# Altium schematic sheet ETH_SWITCH.SchDoc
size 594 x 420 mm; PageSetup: Record=PageOptions|CenterHorizontal=True|CenterVertical=True|PrintScale=0.94|XCorrection=1.00|YCorrection=1.00|PrintKind=1|BorderSize=5000000|LeftOffset=0|BottomOffset=0|Orientation=1|PaperLength=1000|PaperWidth=1000|Scale=100|PaperSource=7|PrintQuality=-4|MediaType=1|DitherType=10|PaperKind=A4|PrintScaleMode=1; Address1: Address1; Address2: Address2; Address3: Address3; Address4: Address4
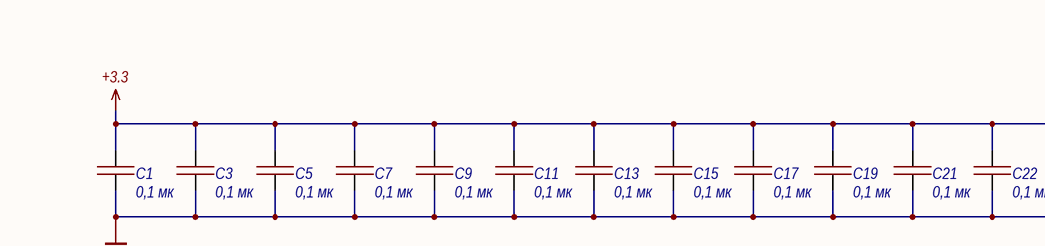
[diagram p0: ETH_SWITCH.SchDoc, top left]
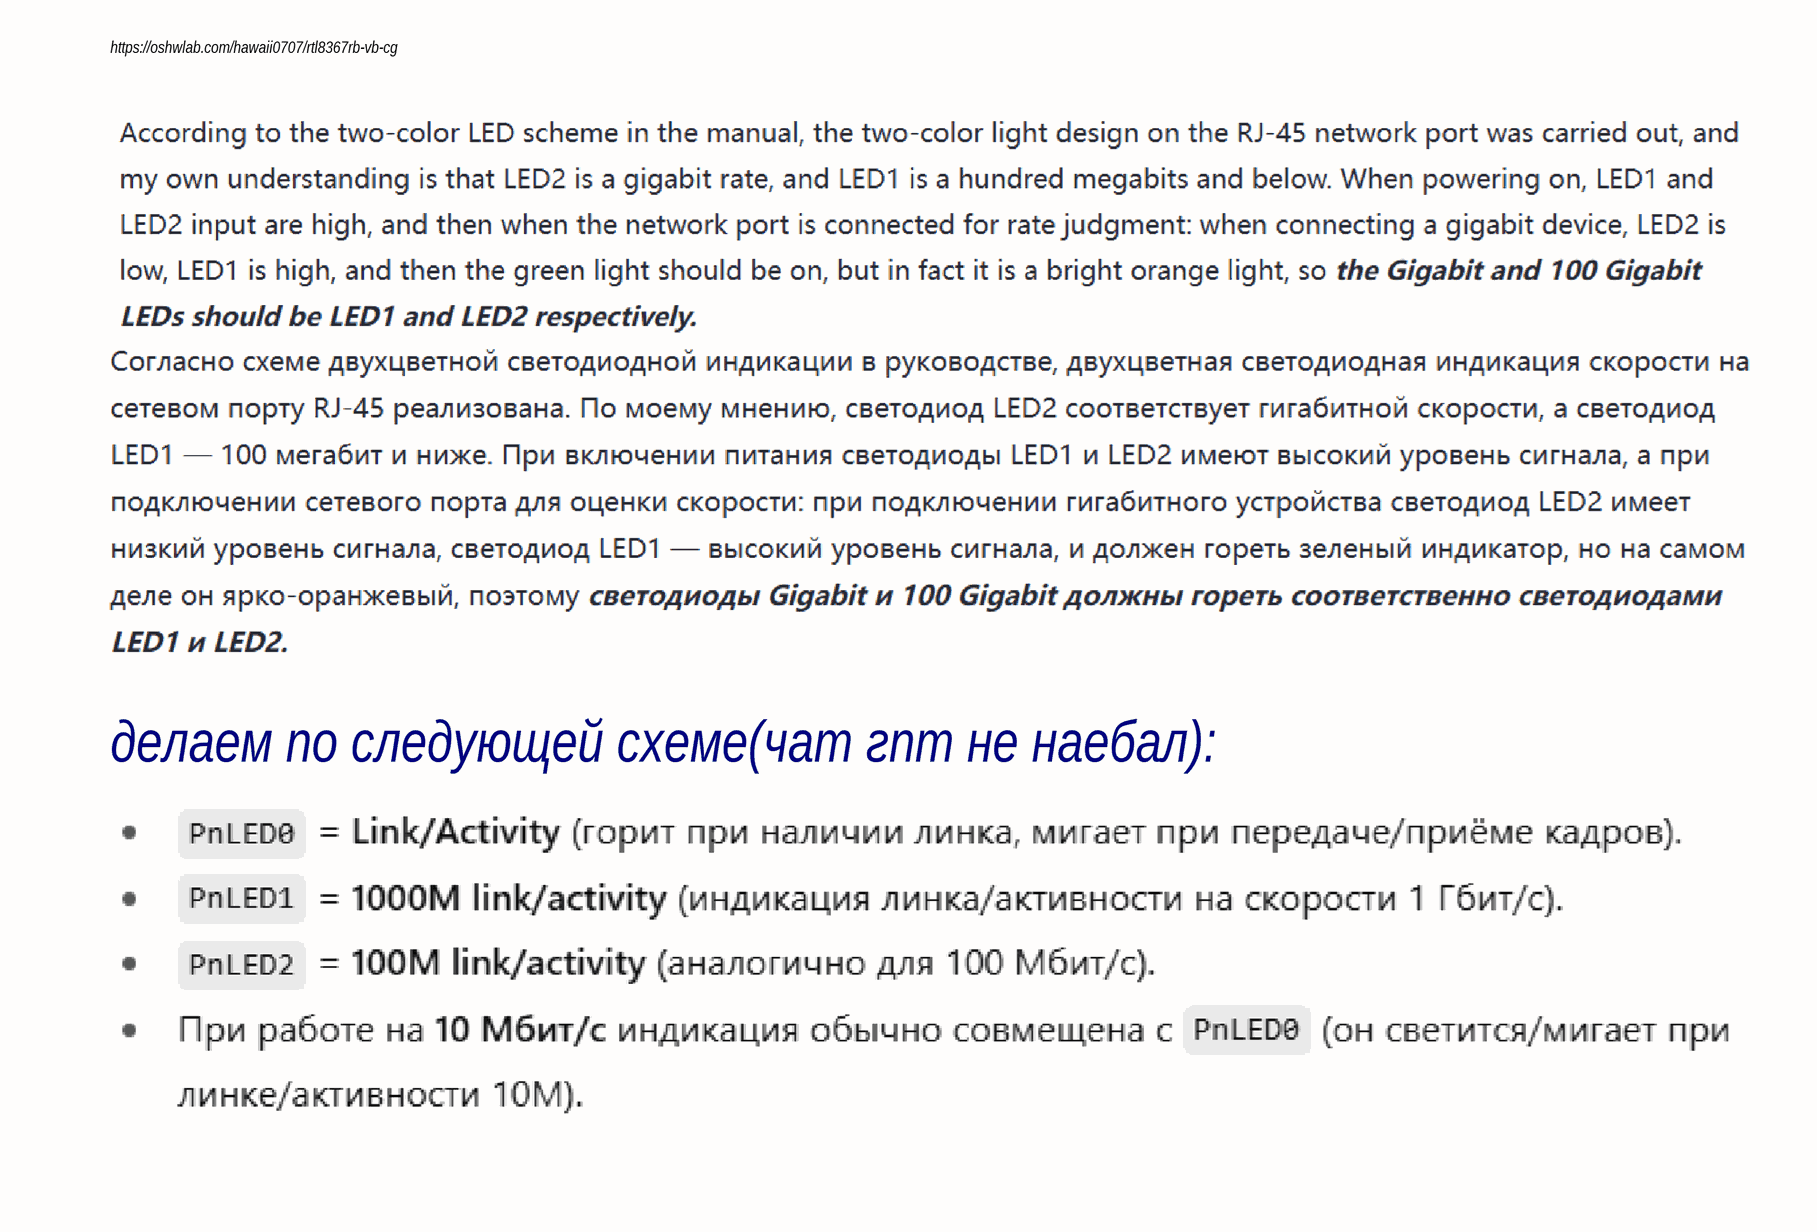
[diagram p1: ETH_SWITCH.SchDoc, top right]
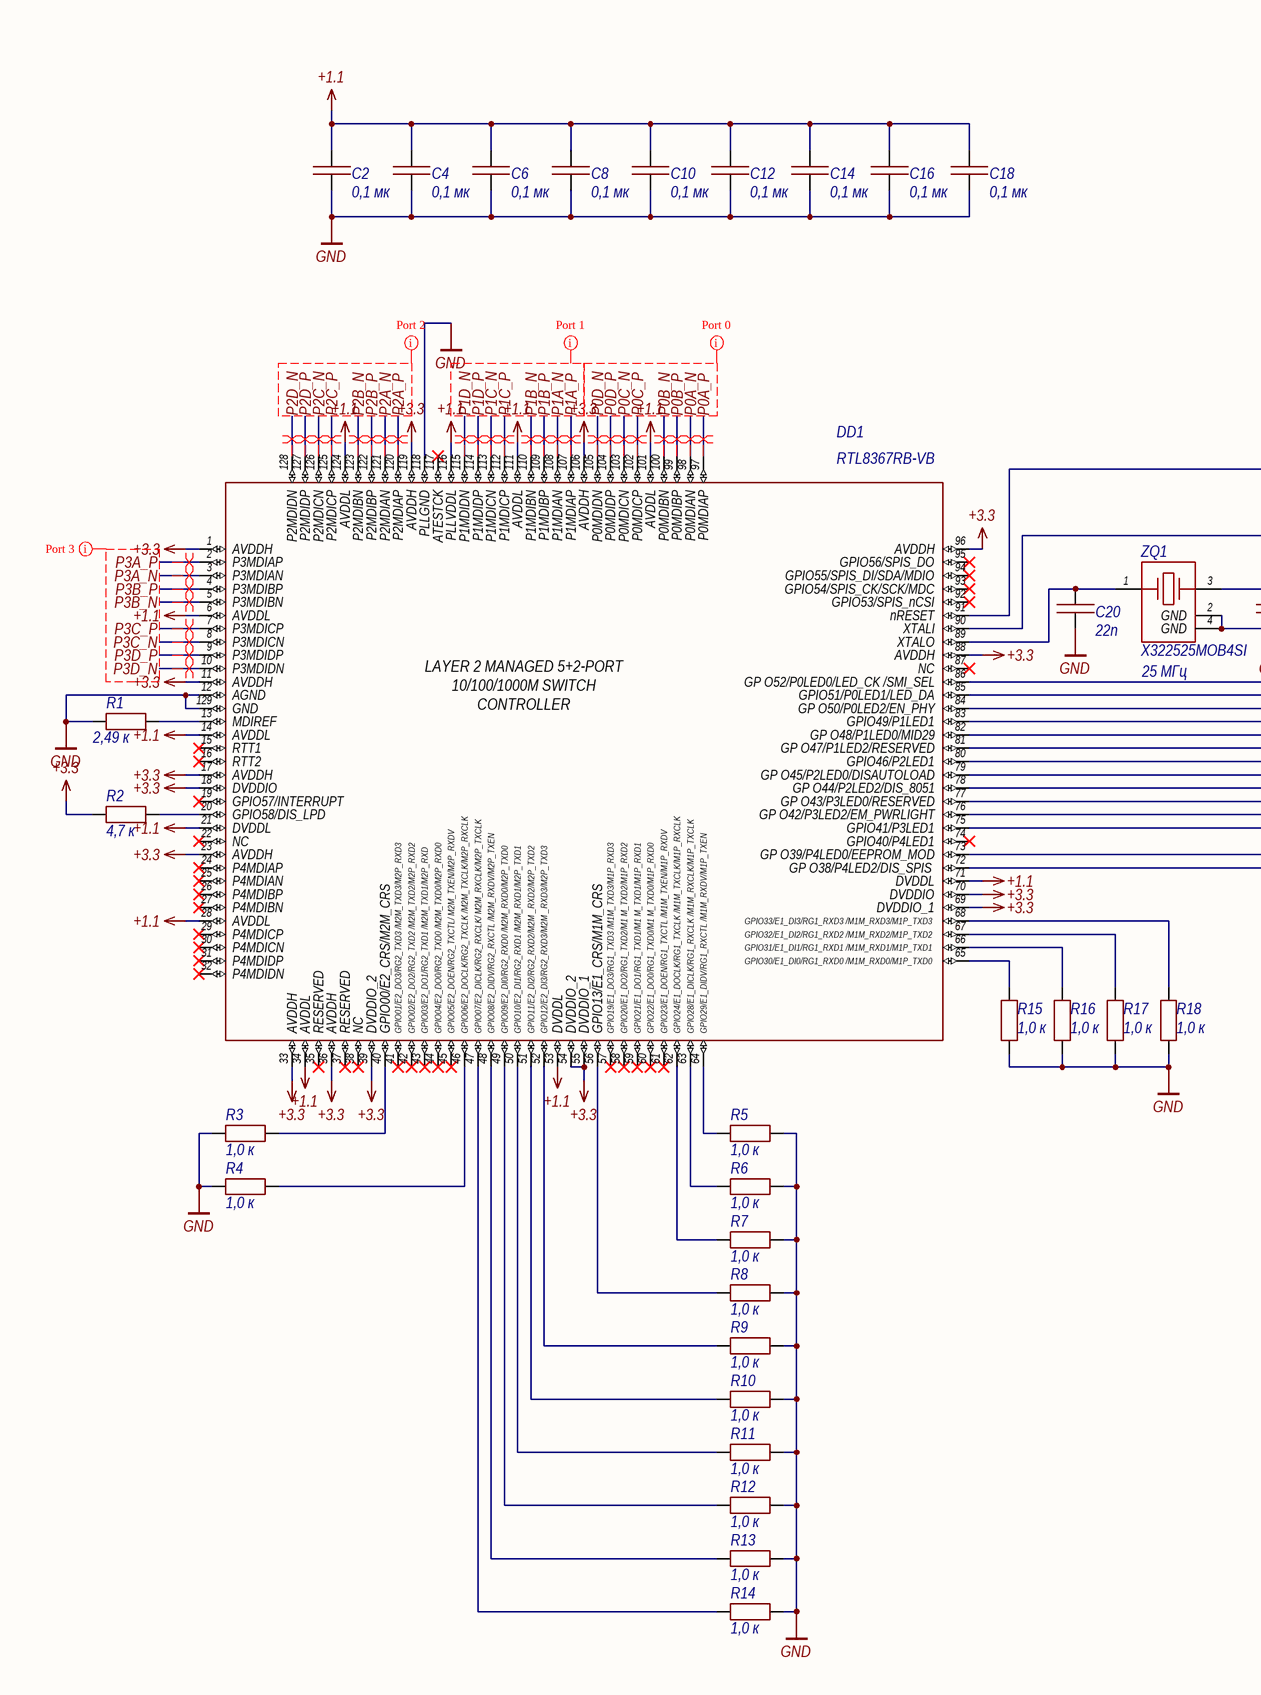
[diagram p2: ETH_SWITCH.SchDoc, bottom left]
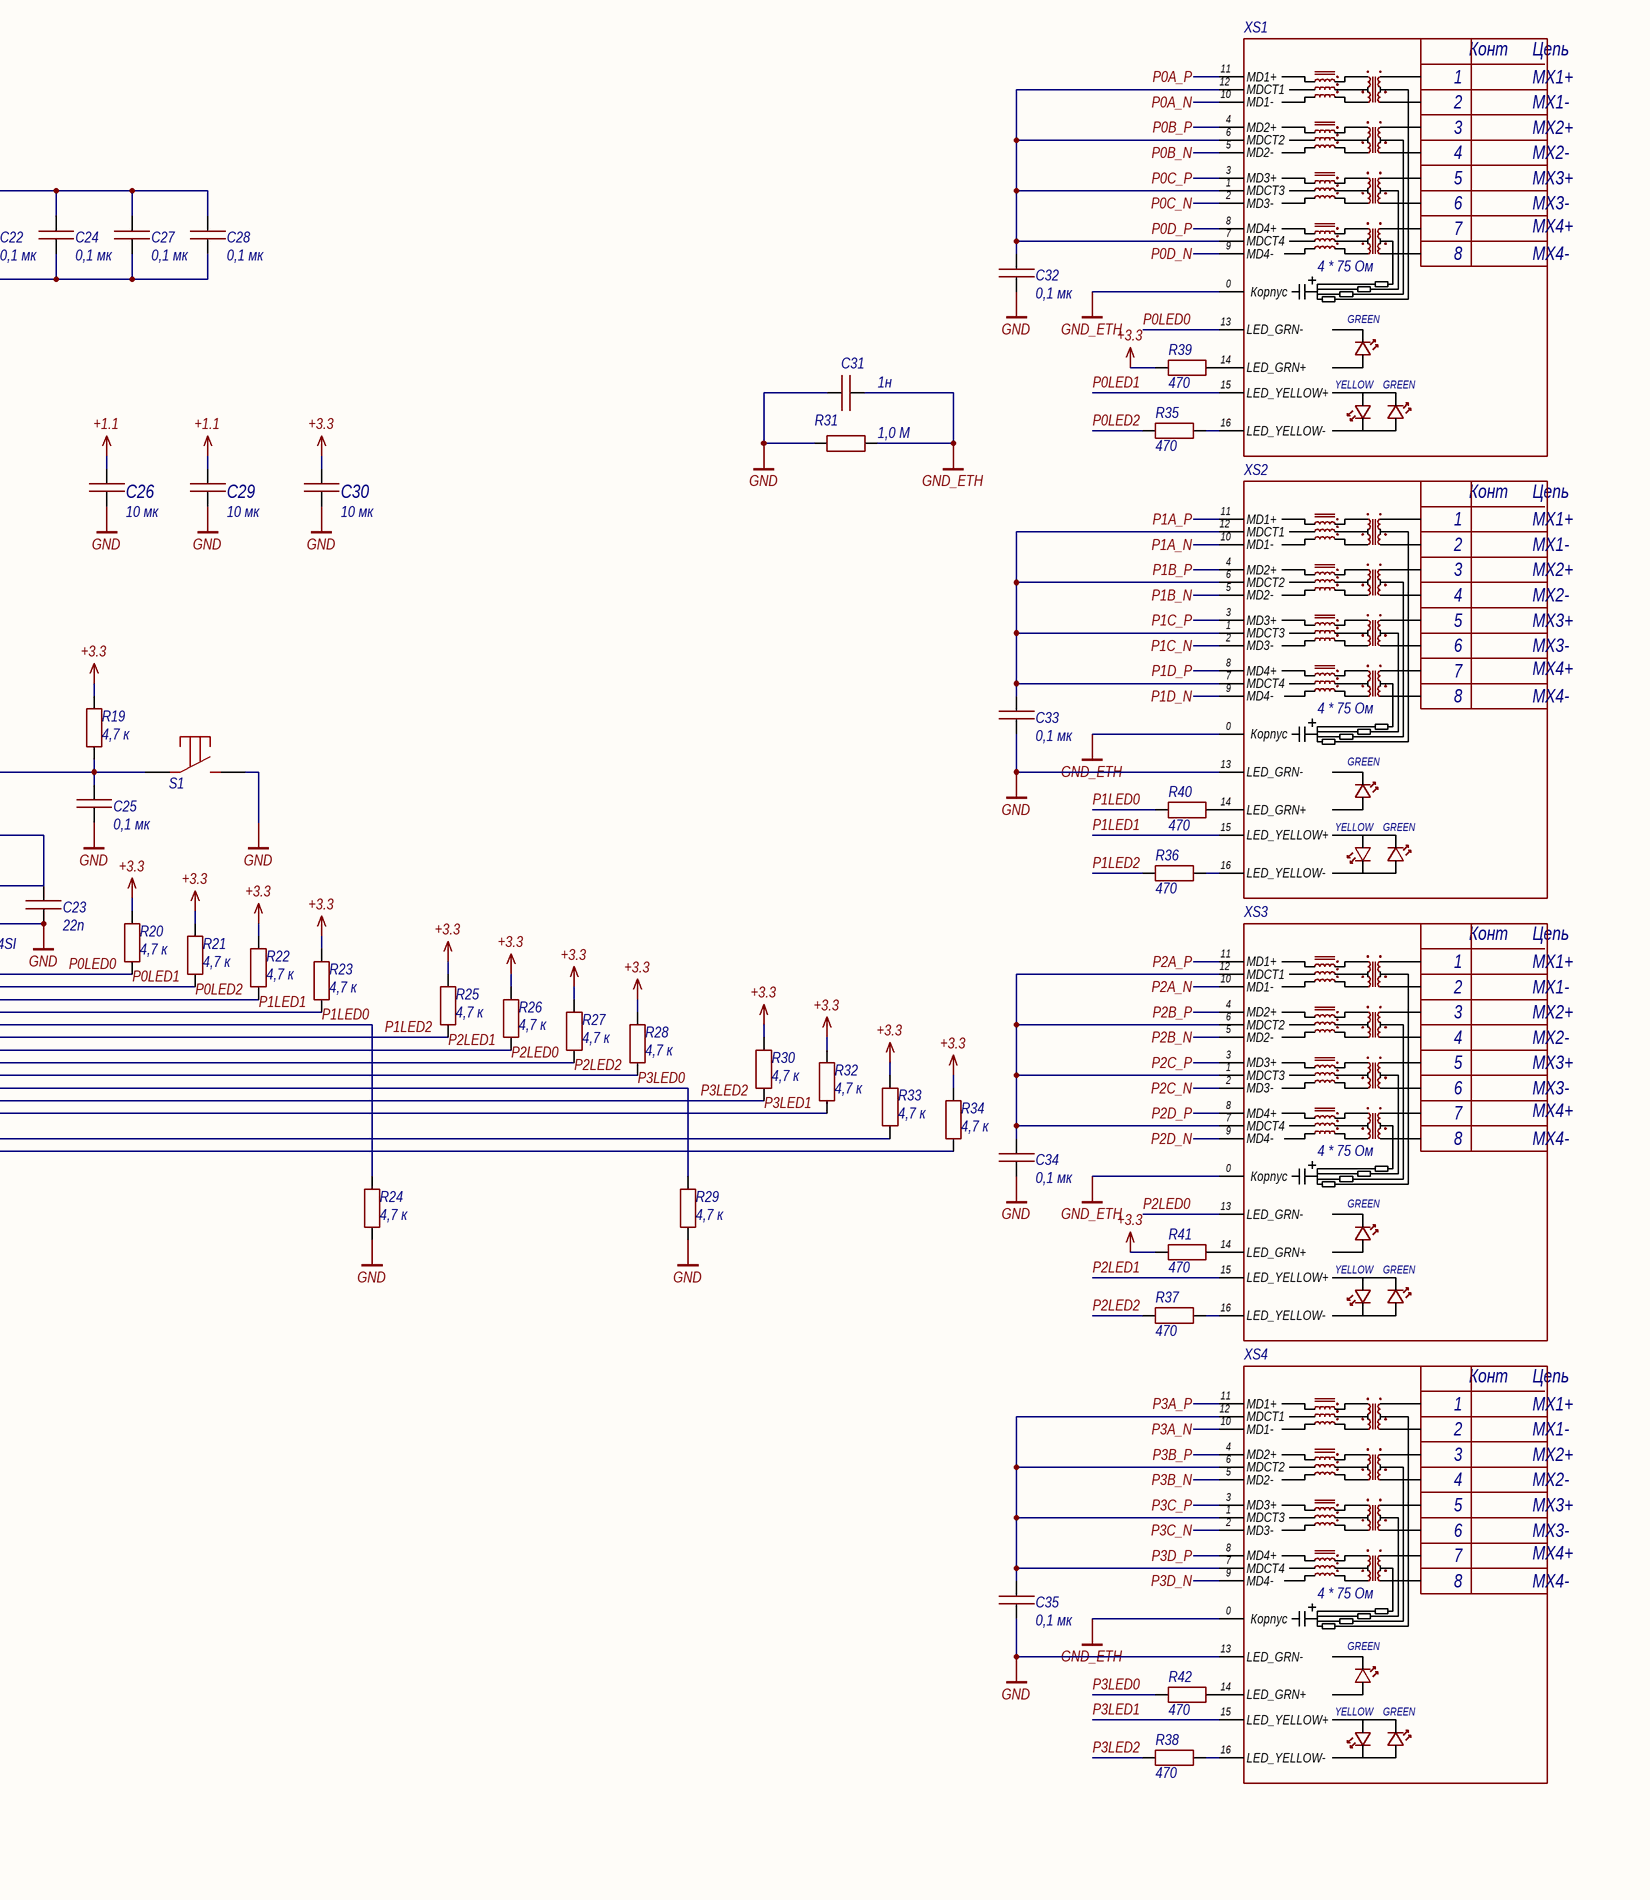
[diagram p3: ETH_SWITCH.SchDoc, bottom right]

## Parts
C1  value 0,1 мк  [0402C]  (hidden comment: Capacitor)
C2  value 0,1 мк  [0402C]  (hidden comment: Capacitor)
C3  value 0,1 мк  [0402C]  (hidden comment: Capacitor)
C4  value 0,1 мк  [0402C]  (hidden comment: Capacitor)
C5  value 0,1 мк  [0402C]  (hidden comment: Capacitor)
C6  value 0,1 мк  [0402C]  (hidden comment: Capacitor)
C7  value 0,1 мк  [0402C]  (hidden comment: Capacitor)
C8  value 0,1 мк  [0402C]  (hidden comment: Capacitor)
C9  value 0,1 мк  [0402C]  (hidden comment: Capacitor)
C10  value 0,1 мк  [0402C]  (hidden comment: Capacitor)
C11  value 0,1 мк  [0402C]  (hidden comment: Capacitor)
C12  value 0,1 мк  [0402C]  (hidden comment: Capacitor)
C13  value 0,1 мк  [0402C]  (hidden comment: Capacitor)
C14  value 0,1 мк  [0402C]  (hidden comment: Capacitor)
C15  value 0,1 мк  [0402C]  (hidden comment: Capacitor)
C16  value 0,1 мк  [0402C]  (hidden comment: Capacitor)
C17  value 0,1 мк  [0402C]  (hidden comment: Capacitor)
C18  value 0,1 мк  [0402C]  (hidden comment: Capacitor)
C19  value 0,1 мк  [0402C]  (hidden comment: Capacitor)
C20  value 22п  [0603C]  (hidden comment: GRM1885C1H220J)
C21  value 0,1 мк  [0402C]  (hidden comment: Capacitor)
C22  value 0,1 мк  [0402C]  (hidden comment: Capacitor)
C23  value 22п  [0603C]  (hidden comment: GRM1885C1H220J)
C24  value 0,1 мк  [0402C]  (hidden comment: Capacitor)
C25  value 0,1 мк  [0603C]  (hidden comment: Capacitor)
C26  value 10 мк  [1210C]  (hidden comment: Capacitor)
C27  value 0,1 мк  [0402C]  (hidden comment: Capacitor)
C28  value 0,1 мк  [0402C]  (hidden comment: Capacitor)
C29  value 10 мк  [1210C]  (hidden comment: Capacitor)
C30  value 10 мк  [1210C]  (hidden comment: Capacitor)
C31  value 1н  [1210C]  (hidden comment: Capacitor)
C32  value 0,1 мк  [0603C]  (hidden comment: Capacitor)
C33  value 0,1 мк  [0603C]  (hidden comment: Capacitor)
C34  value 0,1 мк  [0603C]  (hidden comment: Capacitor)
C35  value 0,1 мк  [0603C]  (hidden comment: Capacitor)
DD1  RTL8367RB-VB  [LQFP128_14x14_exposed_pad]
R1  value 2,49 к  [0603R]  (hidden comment: RC0603FR-072K49L)
R2  value 4,7 к  [0402R]  (hidden comment: Resistor)
R3  value 1,0 к  [0402R]  (hidden comment: Resistor)
R4  value 1,0 к  [0402R]  (hidden comment: Resistor)
R5  value 1,0 к  [0402R]  (hidden comment: Resistor)
R6  value 1,0 к  [0402R]  (hidden comment: Resistor)
R7  value 1,0 к  [0402R]  (hidden comment: Resistor)
R8  value 1,0 к  [0402R]  (hidden comment: Resistor)
R9  value 1,0 к  [0402R]  (hidden comment: Resistor)
R10  value 1,0 к  [0402R]  (hidden comment: Resistor)
R11  value 1,0 к  [0402R]  (hidden comment: Resistor)
R12  value 1,0 к  [0402R]  (hidden comment: Resistor)
R13  value 1,0 к  [0402R]  (hidden comment: Resistor)
R14  value 1,0 к  [0402R]  (hidden comment: Resistor)
R15  value 1,0 к  [0402R]  (hidden comment: Resistor)
R16  value 1,0 к  [0402R]  (hidden comment: Resistor)
R17  value 1,0 к  [0402R]  (hidden comment: Resistor)
R18  value 1,0 к  [0402R]  (hidden comment: Resistor)
R19  value 4,7 к  [0402R]  (hidden comment: Resistor)
R20  value 4,7 к  [0402R]  (hidden comment: Resistor)
R21  value 4,7 к  [0402R]  (hidden comment: Resistor)
R22  value 4,7 к  [0402R]  (hidden comment: Resistor)
R23  value 4,7 к  [0402R]  (hidden comment: Resistor)
R24  value 4,7 к  [0402R]  (hidden comment: Resistor)
R25  value 4,7 к  [0402R]  (hidden comment: Resistor)
R26  value 4,7 к  [0402R]  (hidden comment: Resistor)
R27  value 4,7 к  [0402R]  (hidden comment: Resistor)
R28  value 4,7 к  [0402R]  (hidden comment: Resistor)
R29  value 4,7 к  [0402R]  (hidden comment: Resistor)
R30  value 4,7 к  [0402R]  (hidden comment: Resistor)
R31  value 1,0 М  [0603R]  (hidden comment: Resistor)
R32  value 4,7 к  [0402R]  (hidden comment: Resistor)
R33  value 4,7 к  [0402R]  (hidden comment: Resistor)
R34  value 4,7 к  [0402R]  (hidden comment: Resistor)
R35  value 470  [0402R]  (hidden comment: Resistor)
R36  value 470  [0402R]  (hidden comment: Resistor)
R37  value 470  [0402R]  (hidden comment: Resistor)
R38  value 470  [0402R]  (hidden comment: Resistor)
R39  value 470  [0402R]  (hidden comment: Resistor)
R40  value 470  [0402R]  (hidden comment: Resistor)
R41  value 470  [0402R]  (hidden comment: Resistor)
R42  value 470  [0402R]  (hidden comment: Resistor)
S1  Tact_button  [Button_SMD_6x6]  (value not drawn)
XS1  (no value)  [JK00136NL]
XS2  (no value)  [JK00136NL]
XS3  (no value)  [JK00136NL]
XS4  (no value)  [JK00136NL]
ZQ1  X322525MOB4SI  value 25 МГц  [X322525MOB4SI]

## Nets
+1.1: C2.2 C4.2 C6.2 C8.2 C10.2 C12.2 C14.2 C16.2 C18.2 C26.2 C29.2 DD1.6(AVDDL) DD1.14(AVDDL) DD1.21(DVDDL) DD1.28(AVDDL) DD1.34(AVDDL) DD1.53(DVDDL) DD1.71(DVDDL) DD1.101(AVDDL) DD1.111(AVDDL) DD1.116(PLLVDDL) DD1.124(AVDDL)
+3.3: C1.2 C3.2 C5.2 C7.2 C9.2 C11.2 C13.2 C15.2 C17.2 C19.2 C21.2 C22.2 C24.2 C27.2 C28.2 C30.2 DD1.1(AVDDH) DD1.11(AVDDH) DD1.17(AVDDH) DD1.18(DVDDIO) DD1.23(AVDDH) DD1.33(AVDDH) DD1.36(AVDDH) DD1.39(DVDDIO_2) DD1.54(DVDDIO_2) DD1.55(DVDDIO_1) DD1.69(DVDDIO_1) DD1.70(DVDDIO) DD1.88(AVDDH) DD1.96(AVDDH) DD1.106(AVDDH) DD1.119(AVDDH) R2.1 R19.2 R20.2 R21.2 R22.2 R23.2 R25.2 R26.2 R27.2 R28.2 R30.2 R32.2 R33.2 R34.2 R39.1 R41.1
GND: C1.1 C2.1 C3.1 C4.1 C5.1 C6.1 C7.1 C8.1 C9.1 C10.1 C11.1 C12.1 C13.1 C14.1 C15.1 C16.1 C17.1 C18.1 C19.1 C20.1 C21.1 C22.1 C23.2 C24.1 C25.1 C26.1 C27.1 C28.1 C29.1 C30.1 C31.1 C32.2 C33.2 C34.2 C35.2 DD1.12(AGND) DD1.118(PLLGND) DD1.129(GND) R1.1 R3.2 R4.2 R5.1 R6.1 R7.1 R8.1 R9.1 R10.1 R11.1 R12.1 R13.1 R14.1 R15.1 R16.1 R17.1 R18.1 R24.1 R29.1 R31.1 S1.2 XS2.13(LED_GRN-) XS4.13(LED_GRN-) ZQ1.2(GND) ZQ1.4(GND)
GND_ETH: C31.2 R31.2 XS1.0(Корпус) XS2.0(Корпус) XS3.0(Корпус) XS4.0(Корпус)
P0A_N: DD1.98(P0MDIAN) XS1.10(MD1-)
P0A_P: DD1.97(P0MDIAP) XS1.11(MD1+)
P0B_N: DD1.100(P0MDIBN) XS1.5(MD2-)
P0B_P: DD1.99(P0MDIBP) XS1.4(MD2+)
P0C_N: DD1.103(P0MDICN) XS1.2(MD3-)
P0C_P: DD1.102(P0MDICP) XS1.3(MD3+)
P0D_N: DD1.105(P0MDIDN) XS1.9(MD4-)
P0D_P: DD1.104(P0MDIDP) XS1.8(MD4+)
P0LED0: DD1.86(GP_O52/P0LED0/LED_CK_/SMI_SEL) R20.1 XS1.13(LED_GRN-)
P0LED1: DD1.85(GPIO51/P0LED1/LED_DA) R21.1 XS1.15(LED_YELLOW+)
P0LED2: DD1.84(GP_O50/P0LED2/EN_PHY) R22.1 R35.1
P1A_N: DD1.108(P1MDIAN) XS2.10(MD1-)
P1A_P: DD1.107(P1MDIAP) XS2.11(MD1+)
P1B_N: DD1.110(P1MDIBN) XS2.5(MD2-)
P1B_P: DD1.109(P1MDIBP) XS2.4(MD2+)
P1C_N: DD1.113(P1MDICN) XS2.2(MD3-)
P1C_P: DD1.112(P1MDICP) XS2.3(MD3+)
P1D_N: DD1.115(P1MDIDN) XS2.9(MD4-)
P1D_P: DD1.114(P1MDIDP) XS2.8(MD4+)
P1LED0: DD1.82(GP_O48/P1LED0/MID29) R24.2 R40.1
P1LED1: DD1.83(GPIO49/P1LED1) R23.1 XS2.15(LED_YELLOW+)
P1LED2: DD1.81(GP_O47/P1LED2/RESERVED) R25.1 R36.1
P2A_N: DD1.121(P2MDIAN) XS3.10(MD1-)
P2A_P: DD1.120(P2MDIAP) XS3.11(MD1+)
P2B_N: DD1.123(P2MDIBN) XS3.5(MD2-)
P2B_P: DD1.122(P2MDIBP) XS3.4(MD2+)
P2C_N: DD1.126(P2MDICN) XS3.2(MD3-)
P2C_P: DD1.125(P2MDICP) XS3.3(MD3+)
P2D_N: DD1.128(P2MDIDN) XS3.9(MD4-)
P2D_P: DD1.127(P2MDIDP) XS3.8(MD4+)
P2LED0: DD1.79(GP_O45/P2LED0/DISAUTOLOAD) R27.1 XS3.13(LED_GRN-)
P2LED1: DD1.80(GPIO46/P2LED1) R26.1 XS3.15(LED_YELLOW+)
P2LED2: DD1.78(GP_O44/P2LED2/DIS_8051) R28.1 R37.1
P3A_N: DD1.3(P3MDIAN) XS4.10(MD1-)
P3A_P: DD1.2(P3MDIAP) XS4.11(MD1+)
P3B_N: DD1.5(P3MDIBN) XS4.5(MD2-)
P3B_P: DD1.4(P3MDIBP) XS4.4(MD2+)
P3C_N: DD1.8(P3MDICN) XS4.2(MD3-)
P3C_P: DD1.7(P3MDICP) XS4.3(MD3+)
P3D_N: DD1.10(P3MDIDN) XS4.9(MD4-)
P3D_P: DD1.9(P3MDIDP) XS4.8(MD4+)
P3LED0: DD1.77(GP_O43/P3LED0/RESERVED) R29.2 R42.1
P3LED1: DD1.75(GPIO41/P3LED1) R32.1 XS4.15(LED_YELLOW+)
P3LED2: DD1.76(GP_O42/P3LED2/EM_PWRLIGHT) R30.1 R38.1
NetC20_2: C20.2 DD1.89(XTALO) ZQ1.1
NetC23_1: C23.1 DD1.90(XTALI) ZQ1.3
NetC25_2: C25.2 DD1.91(nRESET) R19.1 S1.1
NetC32_1: C32.1 XS1.1(MDCT3) XS1.6(MDCT2) XS1.7(MDCT4) XS1.12(MDCT1)
NetC33_1: C33.1 XS2.1(MDCT3) XS2.6(MDCT2) XS2.7(MDCT4) XS2.12(MDCT1)
NetC34_1: C34.1 XS3.1(MDCT3) XS3.6(MDCT2) XS3.7(MDCT4) XS3.12(MDCT1)
NetC35_1: C35.1 XS4.1(MDCT3) XS4.6(MDCT2) XS4.7(MDCT4) XS4.12(MDCT1)
NetDD1_13: DD1.13(MDIREF) R1.2
NetDD1_20: DD1.20(GPIO58/DIS_LPD) R2.2
NetDD1_40: DD1.40(GPIO00/E2_CRS/M2M_CRS) R3.1
NetDD1_46: DD1.46(GPIO06/E2_DOCLK/RG2_TXCLK_/M2M_TXCLK/M2P_RXCLK) R4.1
NetDD1_47: DD1.47(GPIO07/E2_DICLK/RG2_RXCLK/_M2M_RXCLK/M2P_TXCLK) R14.2
NetDD1_48: DD1.48(GPIO08/E2_DIDV/RG2_RXCTL_/M2M_RXDV/M2P_TXEN) R13.2
NetDD1_49: DD1.49(GPIO09/E2_DI0/RG2_RXD0_/M2M_RXD0/M2P_TXD0) R12.2
NetDD1_50: DD1.50(GPIO10/E2_DI1/RG2_RXD1_/M2M_RXD1/M2P_TXD1) R11.2
NetDD1_51: DD1.51(GPIO11/E2_DI2/RG2_RXD2/M2M__RXD2/M2P_TXD2) R10.2
NetDD1_52: DD1.52(GPIO12/E2_DI3/RG2_RXD3/M2M__RXD3/M2P_TXD3) R9.2
NetDD1_56: DD1.56(GPIO13/E1_CRS/M1M_CRS) R8.2
NetDD1_62: DD1.62(GPIO24/E1_DOCLK/RG1_TXCLK_/M1M_TXCLK/M1P_RXCLK) R7.2
NetDD1_63: DD1.63(GPIO28/E1_DICLK/RG1_RXCLK_/M1M_RXCLK/M1P_TXCLK) R6.2
NetDD1_64: DD1.64(GPIO29/E1_DIDV/RG1_RXCTL_/M1M_RXDV/M1P_TXEN) R5.2
NetDD1_65: DD1.65(GPIO30/E1_DI0/RG1_RXD0_/M1M_RXD0/M1P_TXD0) R15.2
NetDD1_66: DD1.66(GPIO31/E1_DI1/RG1_RXD1_/M1M_RXD1/M1P_TXD1) R16.2
NetDD1_67: DD1.67(GPIO32/E1_DI2/RG1_RXD2_/M1M_RXD2/M1P_TXD2) R17.2
NetDD1_68: DD1.68(GPIO33/E1_DI3/RG1_RXD3_/M1M_RXD3/M1P_TXD3) R18.2
NetDD1_72: DD1.72(GP_O38/P4LED2/DIS_SPIS) R34.1
NetDD1_73: DD1.73(GP_O39/P4LED0/EEPROM_MOD) R33.1
NetR35_2: R35.2 XS1.16(LED_YELLOW-)
NetR36_2: R36.2 XS2.16(LED_YELLOW-)
NetR37_2: R37.2 XS3.16(LED_YELLOW-)
NetR38_2: R38.2 XS4.16(LED_YELLOW-)
NetR39_2: R39.2 XS1.14(LED_GRN+)
NetR40_2: R40.2 XS2.14(LED_GRN+)
NetR41_2: R41.2 XS3.14(LED_GRN+)
NetR42_2: R42.2 XS4.14(LED_GRN+)

Not connected (* = marked no-connect by the designer): DD1 15(RTT1)* 16(RTT2)* 19(GPIO57/INTERRUPT)* 22(NC)* 24(P4MDIAP)* 25(P4MDIAN)* 26(P4MDIBP)* 27(P4MDIBN)* 29(P4MDICP)* 30(P4MDICN)* 31(P4MDIDP)* 32(P4MDIDN)* 35(RESERVED)* 37(RESERVED)* 38(NC)* 41(GPIO01/E2_DO3/RG2_TXD3_/M2M_TXD3/M2P_RXD3)* 42(GPIO02/E2_DO2/RG2_TXD2_/M2M_TXD2/M2P_RXD2_)* 43(GPIO03/E2_DO1/RG2_TXD1_/M2M_TXD1/M2P_RXD)* 44(GPIO04/E2_DO0/RG2_TXD0_/M2M_TXD0/M2P_RXD0)* 45(GPIO05/E2_DOEN/RG2_TXCTL/_M2M_TXEN/M2P_RXDV)* 57(GPIO19/E1_DO3/RG1_TXD3_/M1M_TXD3/M1P_RXD3)* 58(GPIO20/E1_DO2/RG1_TXD2/M1_M_TXD2/M1P_RXD2)* 59(GPIO21/E1_DO1/RG1_TXD1/M1_M_TXD1/M1P_RXD1)* 60(GPIO22/E1_DO0/RG1_TXD0/M1_M_TXD0/M1P_RXD0_)* 61(GPIO23/E1_DOEN/RG1_TXCTL_/M1M_TXEN/M1P_RXDV)* 74(GPIO40/P4LED1)* 87(NC)* 92(GPIO53/SPIS_nCSI)* 93(GPIO54/SPIS_CK/SCK/MDC)* 94(GPIO55/SPIS_DI/SDA/MDIO)* 95(GPIO56/SPIS_DO)* 117(ATESTCK)*

## Layout directives
differential pair: P0A_N, P0A_P, P0B_N, P0B_P, P0C_N, P0C_P, P0D_N, P0D_P, P1A_N, P1A_P, P1B_N, P1B_P, P1C_N, P1C_P, P1D_N, P1D_P, P2A_N, P2A_P, P2B_N, P2B_P, P2C_N, P2C_P, P2D_N, P2D_P, P3A_N, P3A_P, P3B_N, P3B_P, P3C_N, P3C_P, P3D_N, P3D_P
net class Port 0: P0A_N, P0A_P, P0B_N, P0B_P, P0C_N, P0C_P, P0D_N, P0D_P
net class Port 1: P1A_N, P1A_P, P1B_N, P1B_P, P1C_N, P1C_P, P1D_N, P1D_P
net class Port 2: P2A_N, P2A_P, P2B_N, P2B_P, P2C_N, P2C_P, P2D_N, P2D_P
net class Port 3: P3A_N, P3A_P, P3B_N, P3B_P, P3C_N, P3C_P, P3D_N, P3D_P

## Notes on the sheet
- https://oshwlab.com/hawaii0707/rtl8367rb-vb-cg
- делаем по следующей схеме(чат гпт не наебал):
- Перв. примен.
- Справ. №
- Подп. и дата
- Инв. № дубл.
- Взам. инв. №
- Разраб.
- Изм.
- Лист
- № докум.
- Подп.
- Дата
- Лит.
- Масса
- Масштаб
- Пров.
- Т.контр.
- Схема электрическая принципиальная
- Листов
- Инв. № подл.
- Утв.
- Н.контр.
- Копировал
- Формат А2
- (in symbol JK0-0136NL) Конт; Цепь; MX1+; MX1-; MX2+; MX2-; MX3+; MX3-; MX4+; MX4-; 4 * 75 Ом; GREEN; YELLOW
- (in symbol RTL8367RB-VB) LAYER 2 MANAGED 5+2-PORT 10/100/1000M SWITCH CONTROLLER

## Library data of the parts
C1-C19 C21 C22 C24 C27 C28 = Capacitor_0,1u_10_16V_X7R_0603C: Конденсатор 0402C ёмкостью 0,1 мк 10%, 16 В, X7R; Voltage (V): 16; Capacity (nF): 100; Автор: rreali; Part Number: Capacitor_0,1u_10_16V_X7R_0603C; Tolerance: 10%; Dielectric: X7R
C20 C23 = GRM1885C1H220J: Конденсатор 0603C ёмкостью 22п 5%, 50 В, NP0; Voltage (V): 50; Capacity (nF): 0,022; Datasheet: https://cdn.promelec.ru/upload/items/2020/02/18/MURATA_MLCC_catalog_C02E_short_.pdf; Part Number: GRM1885C1H220J; Tolerance: 5%; Dielectric: NP0
C25 = Capacitor_0,1u_10_50V_X7R_0603C: Конденсатор 0603C ёмкостью 0,1 мк 10%, 50 В, X7R; Voltage (V): 50; Capacity (nF): 100; Part Number: Capacitor_0,1u_10_50V_X7R_0603C; Tolerance: 10%; Dielectric: X7R
C26 C29 C30 = Capacitor_10u_10_35V_X7R_1210C: Конденсатор; Library Path2: Schematic\Capacitor.SchLib; Tolerance: 0,1; Voltage (V): 35; Dielectric: X7R; Capacity (nF): 10000; Part Number: Capacitor_10u_10_35V_X7R_1210C
C31 = Capacitor_1n_10_1000V_X7R_1206C: Конденсатор 1210C ёмкостью 1н 10%, 1000 В, X7R; Voltage (V): 1000; Capacity (nF): 1; Datasheet: https://static.chipdip.ru/lib/245/DOC027245978.pdf; Part Number: Capacitor_1n_10_1000V_X7R_1206C; Tolerance: 10%; Dielectric: X7R
C32-C35 = Capacitor_0,1u_10_50V_X7R_0603C: Конденсатор 0603C ёмкостью 0,1 мк 10%, 50 В, X7R; Library Path2: Schematic\Capacitor.SchLib; Voltage (V): 50; Capacity (nF): 100; Part Number: Capacitor_0,1u_10_50V_X7R_0603C; Tolerance: 10%; Dielectric: X7R
DD1 = RTL8367RB-VB: Управляемый коммутатор второго уровня на 5+2 порта 10/100/1000M; MF: Realtek; SnapEDA_Link: https://www.snapeda.com/parts/RTL8367RB/Realtek/view-part/?ref=snap; Package: None; MP: RTL8367RB; Check_prices: https://www.snapeda.com/parts/RTL8367RB/Realtek/view-part/?ref=eda; Value: *; Part Number: RTL8367RB-VB; Datasheet: https://static.chipdip.ru/lib/518/DOC041518607.pdf
R1 = RC0603FR-072K49L: 0.1Вт 0603 2.49 кОм, 1%, Чип резистор; Power: *; Part Number: RC0603FR-072K49L; Tolerance: 1%
R2 R19-R30 R32-R34 = Resistor_4.7k_1_0402: Резистор номиналом 4,7 кОм 1%; Автор: rreali; Power: *; Part Number: Resistor_4.7k_1_0402; Tolerance: 1%
R3-R18 = Resistor_1.0k_1_0402: Резистор номиналом 1,0 кОм 1%; Автор: rreali; Power: *; Part Number: Resistor_1.0k_1_0402; Tolerance: 1%
R31 = Resistor_1.0M_1_0603: Резистор номиналом 1,0 МОм 1%; Power: *; Part Number: Resistor_1.0M_1_0603; Tolerance: 1%
R35-R42 = Resistor_470_1_0402: Резистор номиналом 470 Ом 1%; Автор: rreali; Power: *; Part Number: Resistor_470_1_0402; Tolerance: 1%
S1 = Tact_button: Тактовая кнопка; Part Number: Tact_button
XS1-XS4 = JK0-0136NL: Модульный разъем (с трансформатором) Cat5/6, RJ45, Гнездо,  1 порт; MF: Pulse Electronics; System: Connector; Mouser-Purchase-URL: https://snapeda.com/shop?store=Mouser&id=195579; Package: None; MP: JK0-0136NL; DigiKey-Purchase-URL: https://snapeda.com/shop?store=DigiKey&id=195579; Value: *; SnapEDA_Link: https://www.snapeda.com/parts/JK0-0136NL/Pulse%20Electronics%20Network/view-part/195579/?ref=snap; Price: None; Availability: Good; Part Number: JK0-0136NL; Datasheet: https://static.chipdip.ru/lib/746/DOC044746386.pdf
ZQ1 = X322525MOB4SI: Кварцевый резонатор SMD 25 МГц ±10ppm SMD-3225_4P; Part Number: X322525MOB4SI; Datasheet: https://datasheet.lcsc.com/lcsc/Yangxing-Tech-X322525MOB4SI_C9006.pdf